# Altium schematic sheet [6] Power Output.SchDoc: Current Sensing & Output
size A3; Author: Caner ALP; Organization: ALP Electronics; Address1: Axel Oxenstiernas; Address2: Västerås; Address3: 72478; Address4: Sweden; DocumentNumber: 6; SheetNumber: 6; SheetTotal: 7
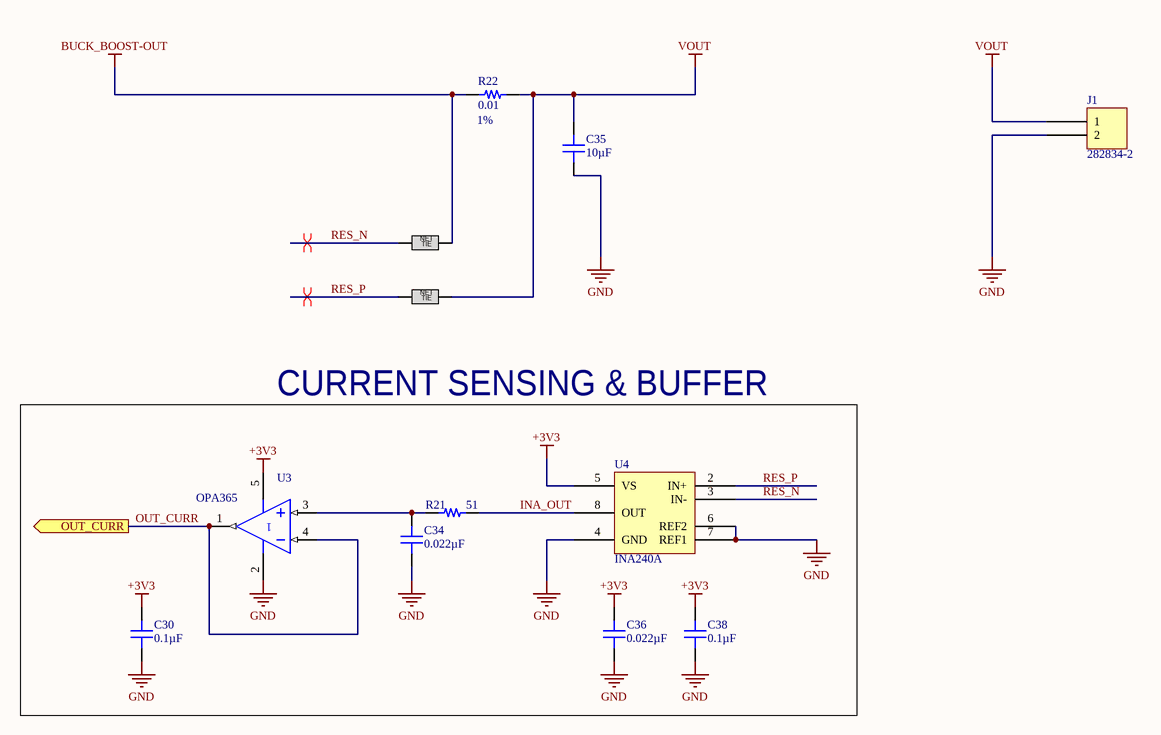
[diagram p0: [6] Power Output.SchDoc]

## Parts
C30  0.1µF  [CAP 0805_2012]
C34  0.022µF  [CAP 0603_1608]
C35  10µF  [CAP 2220_5650 2.5MM]
C36  0.022µF  [CAP 0603_1608]
C38  0.1µF  [CAP 0805_2012]
J1  282834-2  [TE 282834-2]
NetTie3  Net Tie  [Net_Tie_2x0.156mm]  (value not drawn)
NetTie4  Net Tie  [Net_Tie_2x0.156mm]  (value not drawn)
R21  51  [RES 0603/1608]
R22  0.01  Tolerance: 1%  [STACKPOLE CSR2512]
U3  OPA365  [DIODES SOT-23-5 W5]
U4  INA240A  [Atmel TSSOP-8 8X]

## Blocks framed on the sheet
CURRENT SENSING & BUFFER: C30 C34 C36 C38 R21 U3 U4

## Ports
OUT_CURR (out)

## Nets
+3V3: C30.2 C36.2 C38.2 U3.5(V-) U4.5(VS)
BUCK_BOOST-OUT: NetTie3.2 R22.1
GND: C30.1 C34.1 C35.1 C36.1 C38.1 J1.2 U3.2(V+) U4.4(GND) U4.6(REF2) U4.7(REF1)
VOUT: C35.2 J1.1 NetTie4.2 R22.2
INA_OUT: R21.2 U4.8(OUT)
OUT_CURR: U3.1(OUT) U3.4(IN-) ; port OUT_CURR
RES_N: NetTie3.1 U4.3(IN-)
RES_P: NetTie4.1 U4.2(IN+)
NetC34_2: C34.2 R21.1 U3.3(IN+)

Not connected (* = marked no-connect by the designer): U4 1(NC)

## Layout directives
differential pair: RES_N, RES_P

## Notes on the sheet
- Title
- Size:
- Project
- A3
- Revision:
- Date:
- Sheet
- of
- (in symbol Net Tie) NET; TIE

## Library data of the parts
C30 C38 = 160R15W104KV4T: CAP CER 0.1UF 16V X7R 0805; Manufacturer: Johanson Dielectrics Inc.; Tolerance: ±10%; Part Number: 160R15W104KV4T; Value: 0.1µF; Applications: General Purpose; Capacitance: 0.1µF; ComponentLink1Description: Datasheet; ComponentLink1URL: https://www.johansondielectrics.com/downloads/catalog/johanson-dielectrics-product-catalog.pdf; ComponentLink2Description: DigiKey Link; ComponentLink2URL: http://digikey.com/product-detail/en/johanson-dielectrics-inc/160R15W104KV4T/709-1183-1-ND/1859515; Device Package: 0805 (2012 Metric); LastUpdated: 21/01/2020 00:02:56; Lifecycle Status: Active; Minimum Order: 1; Mounting Type: Surface Mount, MLCC; Operating Temperature: -55°C ~ 125°C; Package / Case: 0805 (2012 Metric); Packaging: TapeAndReel; PartId: 9125; Part Status: Active; Price: 0.03; Series: -; Size / Dimension: 0.080" L x 0.050" W (2.03mm x 1.27mm); Supplier 1: DigiKey; Supplier Part Number 1: 709-1183-1-ND; Temperature Coefficient: X7R; Thickness (Max): 0.050" (1.27mm); Voltage - Rated: 16V
C34 C36 = 0603B223J250CT: CAP CER 0.022UF 25V X7R 0603; Manufacturer: Walsin Technology Corporation; Tolerance: ±5%; Part Number: 0603B223J250CT; Value: 0.022µF; Applications: General Purpose; Capacitance: 0.022µF; ComponentLink1Description: Datasheet; ComponentLink1URL: http://www.passivecomponent.com/wp-content/uploads/2018/10/MLCC.pdf; ComponentLink2Description: DigiKey Link; ComponentLink2URL: http://digikey.com/product-detail/en/walsin-technology-corporation/0603B223J250CT/1292-1413-1-ND/9355417; Device Package: 0603 (1608 Metric); LastUpdated: 21/01/2020 00:01:52; Lifecycle Status: Active; Minimum Order: 1; Mounting Type: Surface Mount, MLCC; Operating Temperature: -55°C ~ 125°C; Package / Case: 0603 (1608 Metric); Packaging: TapeAndReel; PartId: 13332; Part Status: Active; Price: 0.01; Series: -; Size / Dimension: 0.063" L x 0.031" W (1.60mm x 0.80mm); Supplier 1: DigiKey; Supplier Part Number 1: 1292-1413-1-ND; Temperature Coefficient: X7R; Thickness (Max): 0.034" (0.87mm); Voltage - Rated: 25V
C35 = C5750X7R1H106M230KB: CAP CER 10UF 50V X7R 2220; Manufacturer: TDK Corporation; Tolerance: ±20%; Part Number: C5750X7R1H106M230KB; Value: 10µF; Applications: General Purpose; Capacitance: 10µF; ComponentLink1Description: Datasheet; ComponentLink1URL: https://product.tdk.com/info/en/catalog/datasheets/mlcc_commercial_general_en.pdf?ref_disty=digikey; ComponentLink2Description: DigiKey Link; ComponentLink2URL: http://digikey.com/product-detail/en/tdk-corporation/C5750X7R1H106M230KB/445-1454-1-ND/569120; Device Package: 2220 (5750 Metric); LastUpdated: 21/01/2020 00:34:55; Lifecycle Status: Active; Minimum Order: 1; Mounting Type: Surface Mount, MLCC; Operating Temperature: -55°C ~ 125°C; Package / Case: 2220 (5750 Metric); Packaging: TapeAndReel; Part Status: Active; Price: 0.85; Series: C; Size / Dimension: 0.224" L x 0.197" W (5.70mm x 5.00mm); Supplier 1: DigiKey; Supplier Part Number 1: 445-1454-1-ND; Temperature Coefficient: X7R; Thickness (Max): 0.098" (2.50mm); Voltage - Rated: 50V
J1 = 282834-2: TERM BLK 2P SIDE ENT 2.54MM PCB; Manufacturer: TE Connectivity AMP Connectors; Current: 10A; Mating Orientation: Horizontal with Board; Number of Levels: 1; Pitch: 0.100" (2.54mm); Positions Per Level: 2; Voltage: 150V; Wire Gauge: 16-30 AWG; Wire Termination: Screw - Rising Cage Clamp; Part Number: 282834-2; Color: Green; ComponentLink1Description: Datasheet; ComponentLink1URL: https://www.te.com/commerce/DocumentDelivery/DDEController?Action=srchrtrv&DocNm=282834&DocType=Customer+Drawing&DocLang=English; ComponentLink2Description: DigiKey Link; ComponentLink2URL: http://digikey.com/product-detail/en/te-connectivity-amp-connectors/282834-2/A98333-ND/1150135; LastUpdated: 15/01/2020 04:15:38; Lifecycle Status: Active; Minimum Order: 1; Mounting Type: Through Hole; Packaging: Bulk; Part Status: Active; Price: 0.88; Series: Buchanan; Supplier 1: DigiKey; Supplier Part Number 1: A98333-ND
R21 = ERJ-3EKF51R0V: RES SMD 51 OHM 1% 1/10W 0603; Manufacturer: Panasonic Electronic Components; TemperatureRange: -55C ~ 155C; TemperatureCoefficient: 100ppm/C; PowerRating: 0.1W, 1/10W; Value: 51; Part Number: ERJ-3EKF51R0V; PartId: 1355; Supplier 1: Digi-Key; Supplier Part Number 1: P51.0HTR-ND; ComponentLink1Description: Datasheet; ComponentLink1URL: http://industrial.panasonic.com/www-cgi/jvcr13pz.cgi?E+PZ+3+AOA0002+ERJ3EKF51R0V+7+WW; ComponentLink2Description: Digi-Key listing; ComponentLink2URL: http://digikey.com/product-detail/en/ERJ-3EKF51R0V/P51.0HTR-ND/1746433; Tolerance: 1%; Price: 0,0038; Type: Thick Film; Device Package: 0603 (1608 Metric)
R22 = CSR2512FK10L0: RES SMD 0.01 OHM 1% 2W 2512; Manufacturer: Stackpole Electronics Inc.; TemperatureRange: -55C ~ 155C; TemperatureCoefficient: 200ppm/C; Value: 0.01; Part Number: CSR2512FK10L0; PartId: 10090; Supplier 1: Digi-Key; Supplier Part Number 1: CSR2512FK10L0-ND; ComponentLink1Description: Datasheet; ComponentLink1URL: http://www.seielect.com/catalog/SEI-CSR_CSRN.pdf; ComponentLink2Description: Digi-Key Listing; ComponentLink2URL: https://www.digikey.com/product-detail/en/stackpole-electronics-inc/CSR2512FK10L0/CSR2512FK10L0-ND/1742503; PowerRating: 2W; Price: 0.22; Device Package: 2512 (6432 Metric)
U3 = 9691: RAIL-TO-RAIL OPAMP SOT-23-5; Published: 15-Apr-2002; LatestRevisionDate: 04-Mar-2005; LatestRevisionNote: Stylized 3D Model Added.; DatasheetVersion: Jan-1989; PackageVersion: Jun-1999; PackageReference: J014; Publisher: Altium Limited; PackageDescription: DIP; 14 Leads; Row Spacing 7.62 mm; Pitch 2.54 mm; ComponentLink1Description: Manufacturer Link; ComponentLink1URL: http://www.ti.com/; ComponentLink2Description: Datasheet; ComponentLink2URL: http://www-s.ti.com/sc/ds/lm224.pdf; PartId: 9691; Part Number: TSV911ILT
U4 = 9694: IC AMP CURRENT SENSE 8-TSSOP; PartId: 9694; Part Number: INA240A